# EAGLE design Sequei_board2 (EAGLE 9.1.1)
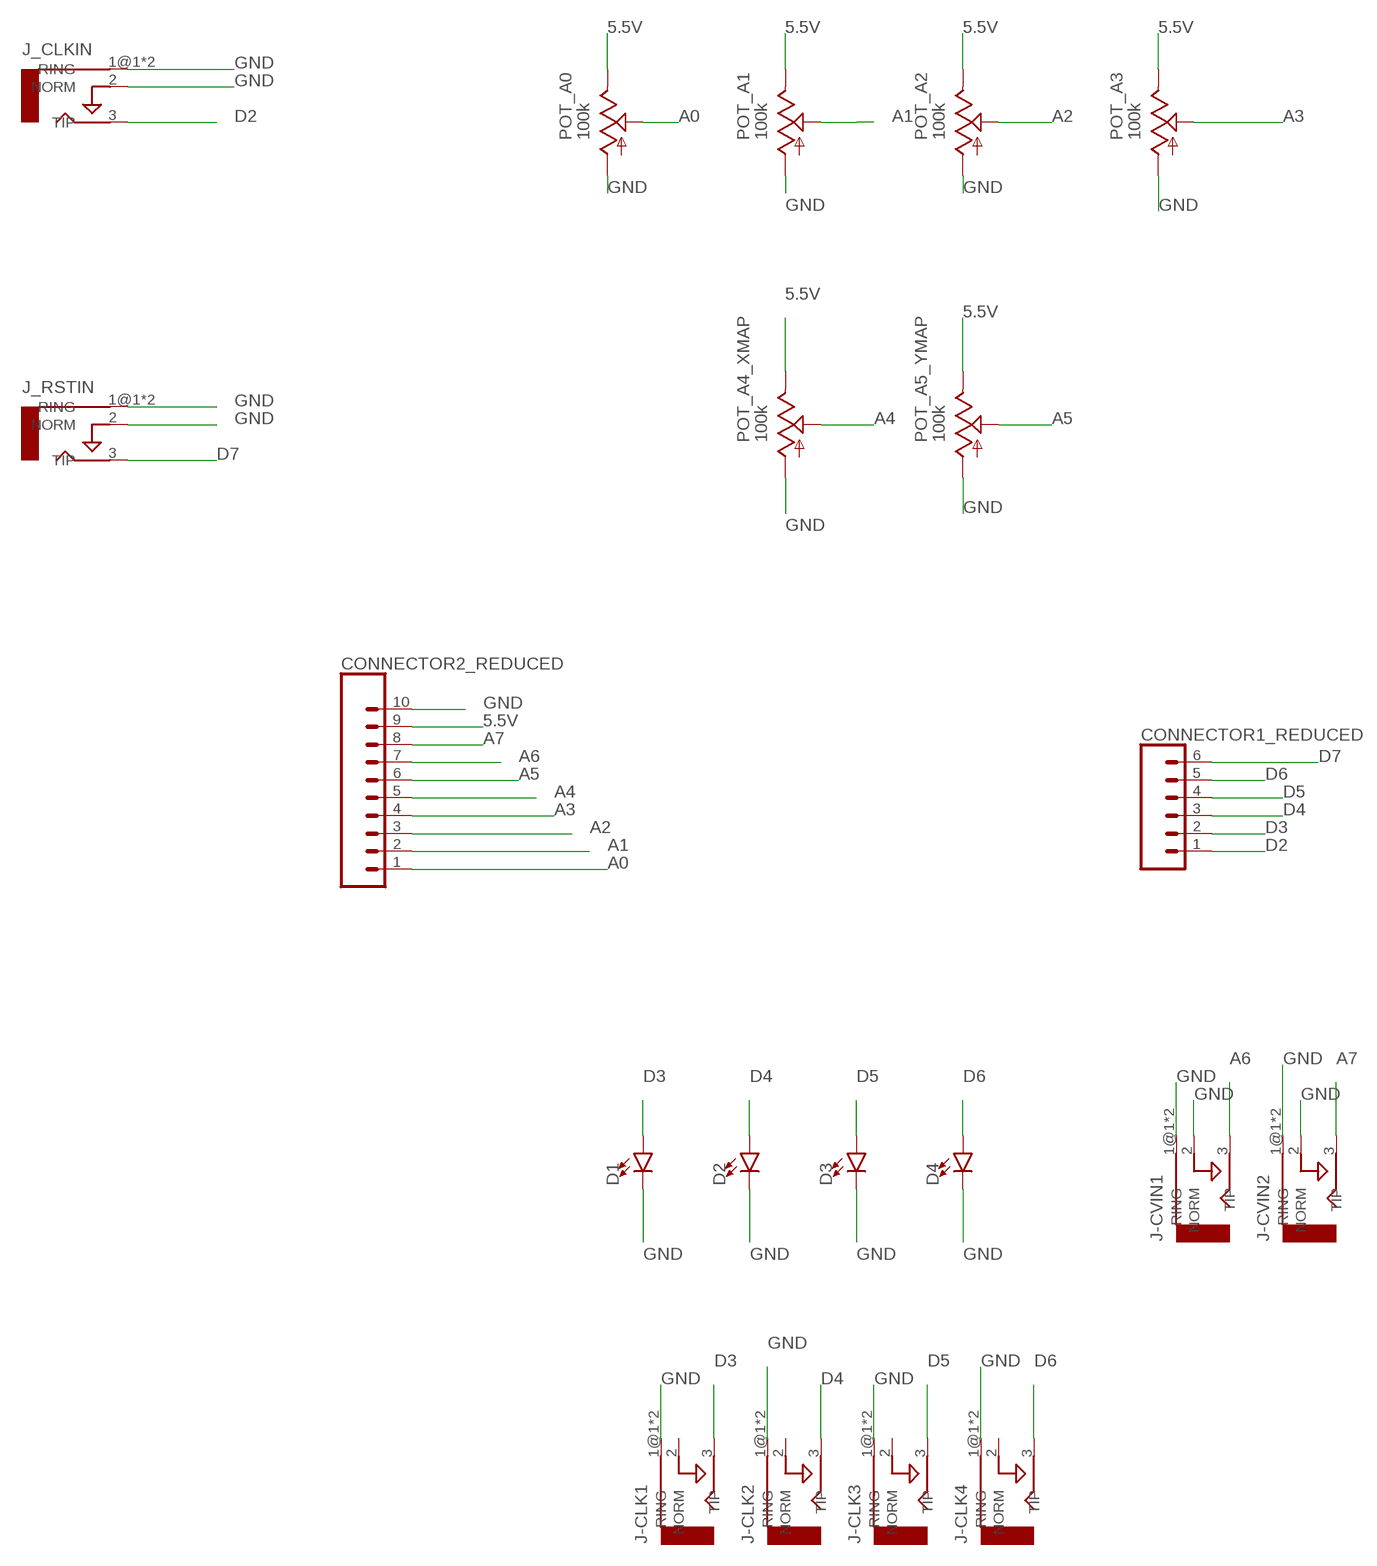
[diagram p0: schematic, sheet 1]

## Parts
CONNECTOR1_REDUCED  CONN_06LONGPADS  [1X06_LONGPADS]
CONNECTOR2_REDUCED  CONN_10_LONGPADS10_LONGPADS  [1X10_LONGPADS]
D1  LED-3MM-NO_SILK  [LED_3MM-NS]
D2  LED-3MM-NO_SILK  [LED_3MM-NS]
D3  LED-3MM-NO_SILK  [LED_3MM-NS]
D4  LED-3MM-NO_SILK  [LED_3MM-NS]
J-CLK1  AUDIO-JACKERTHENVAR  [ERTHENVAR-JACK]
J-CLK2  AUDIO-JACKERTHENVAR  [ERTHENVAR-JACK]
J-CLK3  AUDIO-JACKERTHENVAR  [ERTHENVAR-JACK]
J-CLK4  AUDIO-JACKERTHENVAR  [ERTHENVAR-JACK]
J-CVIN1  AUDIO-JACKERTHENVAR  [ERTHENVAR-JACK]
J-CVIN2  AUDIO-JACKERTHENVAR  [ERTHENVAR-JACK]
J_CLKIN  AUDIO-JACKERTHENVAR  [ERTHENVAR-JACK]
J_RSTIN  AUDIO-JACKERTHENVAR  [ERTHENVAR-JACK]
POT_A0  100k  9MM_SNAP-IN_POT_  [9MM_SNAP-IN_POT]
POT_A1  100k  9MM_SNAP-IN_POT_  [9MM_SNAP-IN_POT]
POT_A2  100k  9MM_SNAP-IN_POT_  [9MM_SNAP-IN_POT]
POT_A3  100k  9MM_SNAP-IN_POT_  [9MM_SNAP-IN_POT]
POT_A4_XMAP  100k  9MM_SNAP-IN_POT_  [9MM_SNAP-IN_POT]
POT_A5_YMAP  100k  9MM_SNAP-IN_POT_  [9MM_SNAP-IN_POT]

## Nets
5.5V: CONNECTOR2_REDUCED.9 POT_A0.3(E) POT_A1.3(E) POT_A2.3(E) POT_A3.3(E) POT_A4_XMAP.3(E) POT_A5_YMAP.3(E)
A0: CONNECTOR2_REDUCED.1 POT_A0.2(S)
A1: CONNECTOR2_REDUCED.2 POT_A1.2(S)
A2: CONNECTOR2_REDUCED.3 POT_A2.2(S)
A3: CONNECTOR2_REDUCED.4 POT_A3.2(S)
A4: CONNECTOR2_REDUCED.5 POT_A4_XMAP.2(S)
A5: CONNECTOR2_REDUCED.6 POT_A5_YMAP.2(S)
A6: CONNECTOR2_REDUCED.7 J-CVIN1.3(TIP)
A7: CONNECTOR2_REDUCED.8 J-CVIN2.3(TIP)
D2: CONNECTOR1_REDUCED.1 J_CLKIN.3(TIP)
D3: CONNECTOR1_REDUCED.2 D1.A J-CLK1.3(TIP)
D4: CONNECTOR1_REDUCED.3 D2.A J-CLK2.3(TIP)
D5: CONNECTOR1_REDUCED.4 D3.A J-CLK3.3(TIP)
D6: CONNECTOR1_REDUCED.5 D4.A J-CLK4.3(TIP)
D7: CONNECTOR1_REDUCED.6 J_RSTIN.3(TIP)
GND: CONNECTOR2_REDUCED.10 D1.K(C) D2.K(C) D3.K(C) D4.K(C) J-CLK1.1@1(RING) J-CLK1.1@2(RING) J-CLK2.1@1(RING) J-CLK2.1@2(RING) J-CLK3.1@1(RING) J-CLK3.1@2(RING) J-CLK4.1@1(RING) J-CLK4.1@2(RING) J-CVIN1.1@1(RING) J-CVIN1.1@2(RING) J-CVIN1.2(NORM) J-CVIN2.1@1(RING) J-CVIN2.1@2(RING) J-CVIN2.2(NORM) J_CLKIN.1@1(RING) J_CLKIN.1@2(RING) J_CLKIN.2(NORM) J_RSTIN.1@1(RING) J_RSTIN.1@2(RING) J_RSTIN.2(NORM) POT_A0.1(A) POT_A1.1(A) POT_A2.1(A) POT_A3.1(A) POT_A4_XMAP.1(A) POT_A5_YMAP.1(A)
Unconnected: J-CLK1.2(NORM) J-CLK2.2(NORM) J-CLK3.2(NORM) J-CLK4.2(NORM)

## Library data of the parts
CONNECTOR1_REDUCED = SparkFun-Connectors:CONN_06: Multi connection point. Often used as Generic Header-pin footprint for 0.1 inch spaced/style header connections On any of the 0.1 inch spaced packages, you can populate with these: Break Away Headers - Straight <https://www.sparkfun.com/products/116> (PRT-00116) Break Away Male Headers - Right Angle <https://www.sparkfun.com/products/553> (PRT-00553) Female Headers <https://www.sparkfun.com/products/115> (PRT-00115) Break Away Headers - Machine Pin <https://www.sparkfun.com/products/117> (PRT-00117) Break Away Female Headers - Swiss Machine Pin <https://www.sparkfun.com/products/743> (PRT-00743) Arduino Stackable Header - 6 Pin <https://www.sparkfun.com/products/9280> (PRT-09280) For SCREWTERMINALS and SPRING TERMINALS visit here: Screw Terimnals on SparkFun.com <https://www.sparkfun.com/search/results?term=Screw+Terminals> (5mm/3.5mm/2.54mm spacing) This device is also useful as a general connection point to wire up your design to another part of your project. Our various solder wires solder well into these plated through hole pads. Hook-Up Wire - Assortment (Stranded, 22 AWG) <https://www.sparkfun.com/products/11375> (PRT-11375) Hook-Up Wire - Assortment (Solid Core, 22 AWG) <https://www.sparkfun.com/products/11367> (PRT-11367) View the entire wire category on our website here <https://www.sparkfun.com/categories/141>
CONNECTOR2_REDUCED = 10_Long_Pads:CONN_10_LONGPADS: Multi connection point. Often used as Generic Header-pin footprint for 0.1 inch spaced/style header connections On any of the 0.1 inch spaced packages, you can populate with these: Break Away Headers - Straight <https://www.sparkfun.com/products/116> (PRT-00116) Break Away Male Headers - Right Angle <https://www.sparkfun.com/products/553> (PRT-00553) Female Headers <https://www.sparkfun.com/products/115> (PRT-00115) Break Away Headers - Machine Pin <https://www.sparkfun.com/products/117> (PRT-00117) Break Away Female Headers - Swiss Machine Pin <https://www.sparkfun.com/products/743> (PRT-00743) For SCREWTERMINALS and SPRING TERMINALS visit here: Screw Terimnals on SparkFun.com <https://www.sparkfun.com/search/results?term=Screw+Terminals> (5mm/3.5mm/2.54mm spacing) This device is also useful as a general connection point to wire up your design to another part of your project. Our various solder wires solder well into these plated through hole pads. Hook-Up Wire - Assortment (Stranded, 22 AWG) <https://www.sparkfun.com/products/11375> (PRT-11375) Hook-Up Wire - Assortment (Solid Core, 22 AWG) <https://www.sparkfun.com/products/11367> (PRT-11367) View the entire wire category on our website here <https://www.sparkfun.com/categories/141>
D1-D4 = SparkFun-LED:LED: LED (Generic) Standard schematic elements and footprints for 5mm, 3mm, 1206, and 0603 sized LEDs. Generic LEDs with no color specified.
J-CLK1-J-CLK4 J-CVIN1 J-CVIN2 J_CLKIN J_RSTIN = erthenvar:AUDIO-JACK: Switching Mono 3.5mm Audio Jack from Erthenvar.
POT_A0 POT_A1-POT_A3 POT_A4_XMAP POT_A5_YMAP = MusicThingModular:9MM_SNAP-IN_POT: 9mm vertical snap-in pot, Alpha / Panasonic style

## Board
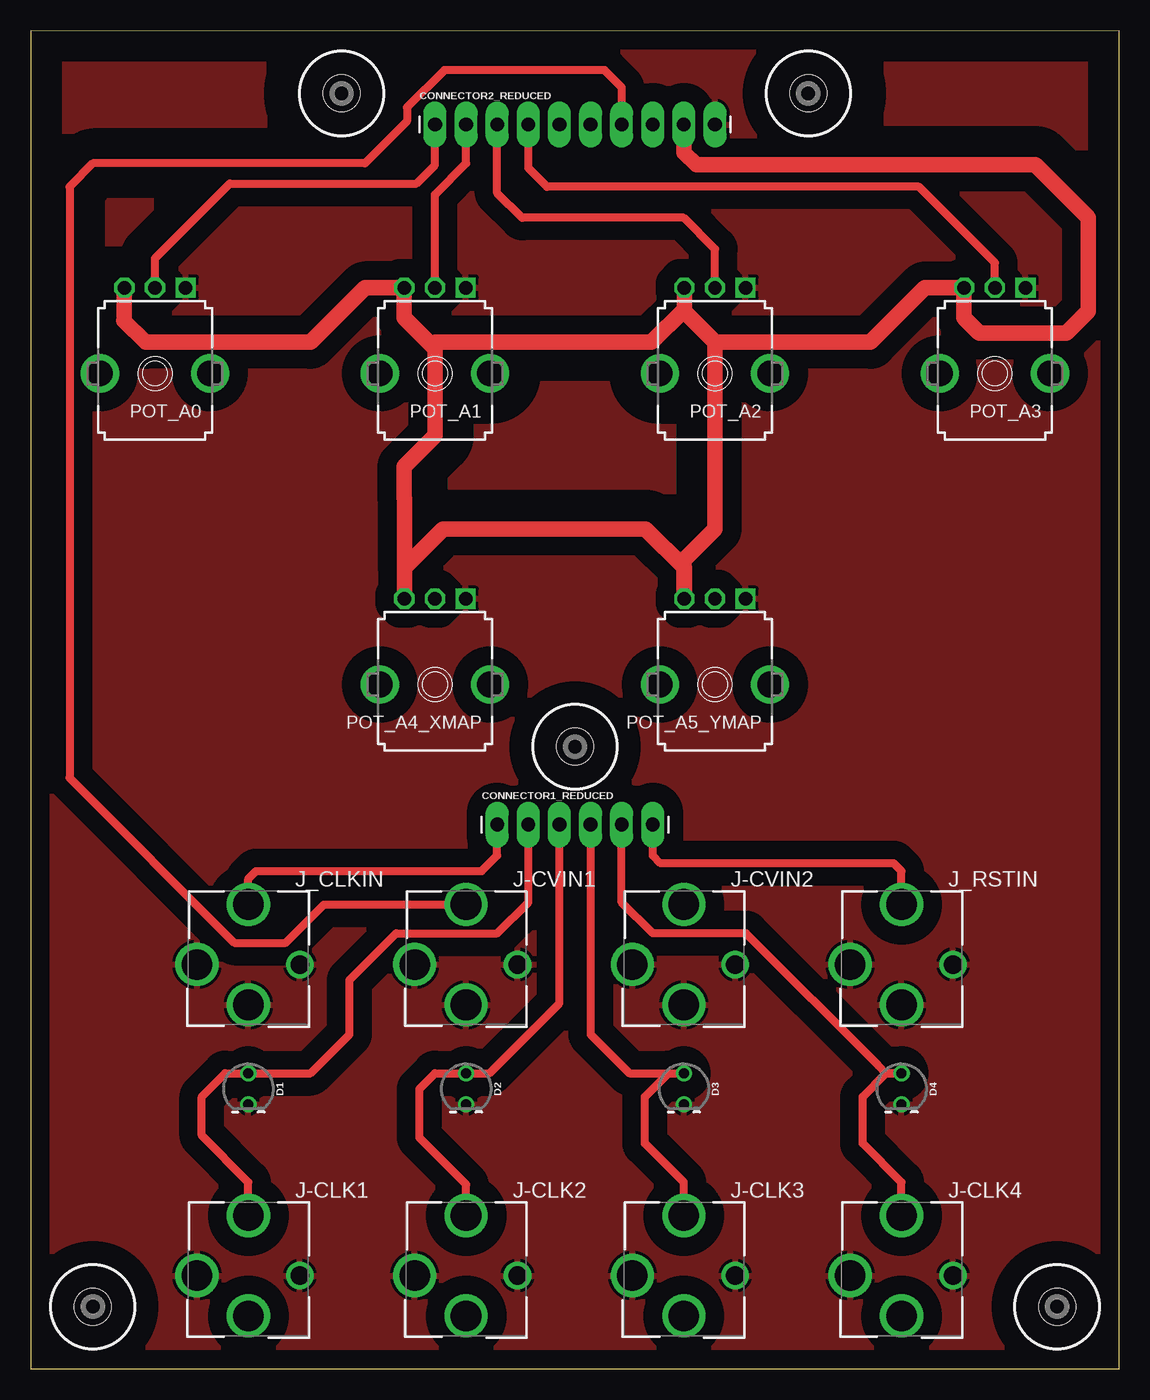
[diagram p1: board, top side]
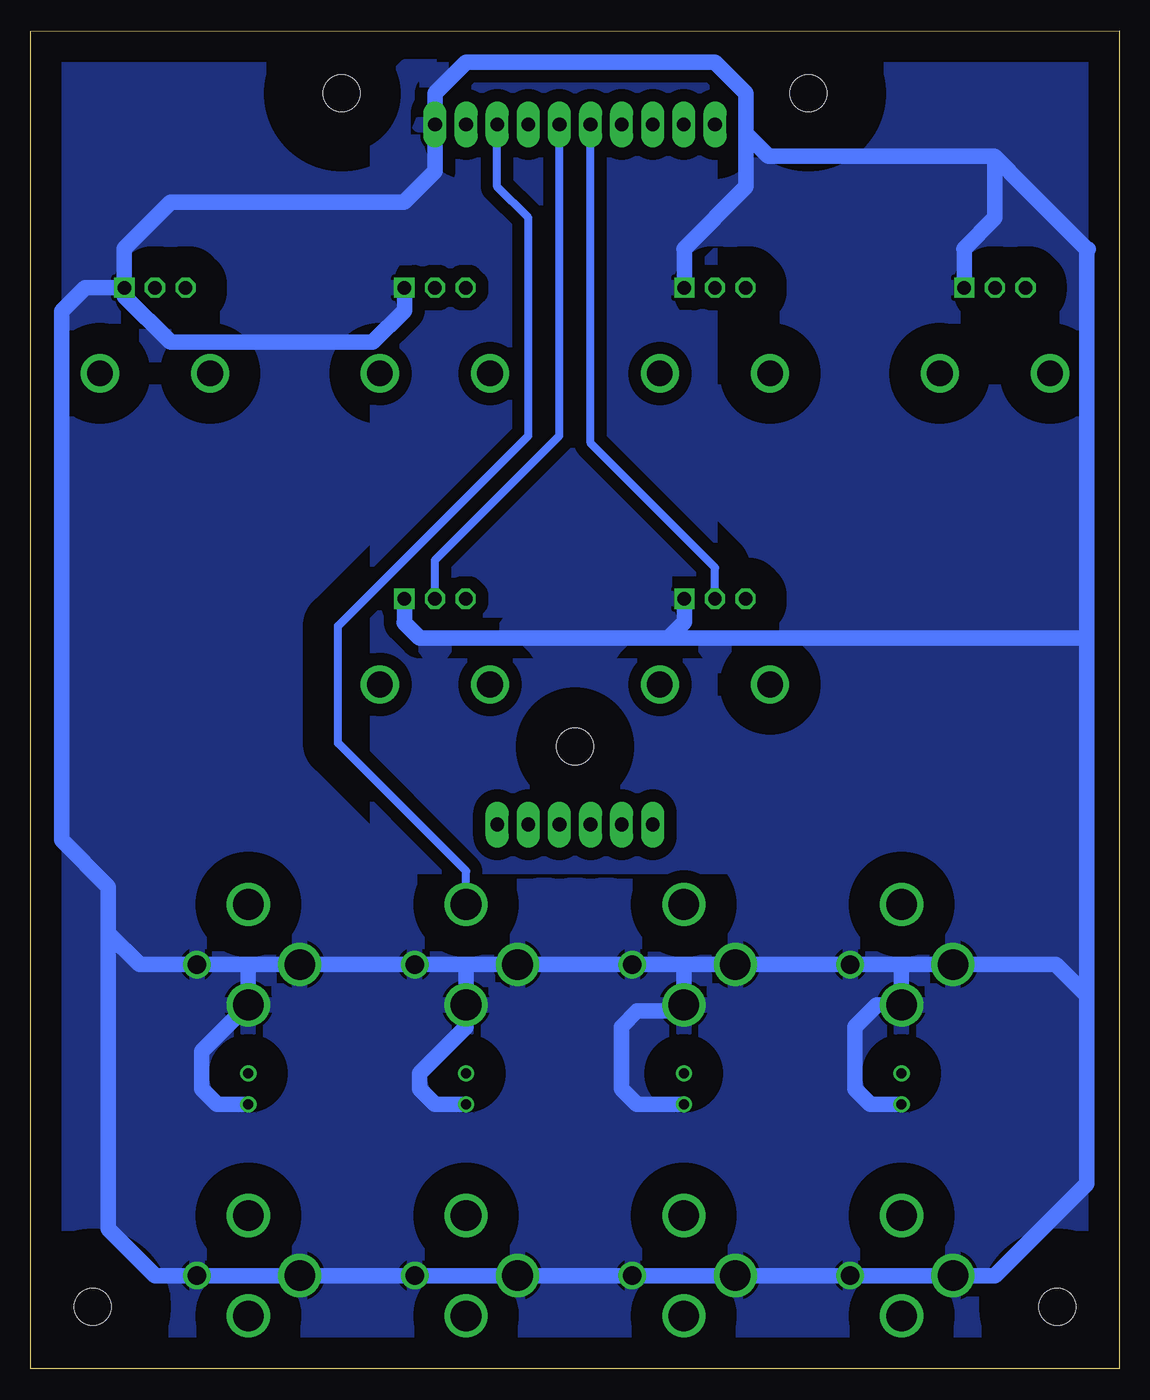
[diagram p2: board, bottom side, seen from below]

Size 88.9 x 109.27 mm. Coordinates in mm from the lower left corner, seen from the top.
Outline: 0,0 88.9,0 88.9,109.22 0,109.27 0,0
Copper layers (1*16): Top 0.035mm / dielectric 1.5mm / Bottom 0.035mm
Design rules "default *": minimum track width 24mil, minimum drill 0.35mm, track to track 6mil, track to pad 6mil, pad to pad 6mil, via to via 6mil, smd to smd 6mil, copper to edge 40mil, drill to drill 12mil, minimum pad ring 10mil, minimum via ring 8mil, stop-mask expansion 4mil, vias tented up to drill 0mil, thermal gap 10mil

### Footprints (pad centres in the part's own frame; a part is rotated, then mirrored left to right if it is on the bottom)
1X06_LONGPADS = drill 1.118 pad 1.88 long: 1 0,0; 2 2.54,0; 3 5.08,0; 4 7.62,0; 5 10.16,0; 6 12.7,0
1X10_LONGPADS = drill 1.118 pad 1.88 long: 1 0,0; 2 2.54,0; 3 5.08,0; 4 7.62,0; 5 10.16,0; 6 12.7,0; 7 15.24,0; 8 17.78,0; 9 20.32,0; 10 22.86,0
LED_3MM-NS = drill 0.813: A -1.27,0; K 1.27,0
DRIL-3 = hole 3: 0,0
ERTHENVAR-JACK = drill 2.5: 1@1 -4.2,0; 2 0,-3.3; 3 0,4.9 | drill 1.5: 1@2 4.2,0
9MM_SNAP-IN_POT = drill 1.1 square: 1 -2.5,-7 | drill 1.1 octagon: 2 0,-7; 3 2.5,-7 | drill 2.1 pad 2.794: CHASSIS1 -4.5,0; CHASSIS2 4.5,0

### Placement (x,y rotation side)
CONNECTOR1_REDUCED  38.1,44.45 0 top
CONNECTOR2_REDUCED  33.02,101.6 0 top
D1  17.78,22.86 270 top
D2  35.56,22.86 270 top
D3  53.34,22.86 270 top
D4  71.12,22.86 270 top
H1  [DRIL-3]  25.4,104.14 0 top
H2  [DRIL-3]  63.5,104.14 0 top
H3  [DRIL-3]  83.82,5.08 0 top
H4  [DRIL-3]  5.08,5.08 0 top
H5  [DRIL-3]  44.45,50.8 0 top
J-CLK1  17.78,7.62 0 top
J-CLK2  35.56,7.62 0 top
J-CLK3  53.34,7.62 0 top
J-CLK4  71.12,7.62 0 top
J-CVIN1  35.56,33.02 0 top
J-CVIN2  53.34,33.02 0 top
J_CLKIN  17.78,33.02 0 top
J_RSTIN  71.12,33.02 0 top
POT_A0  10.16,81.28 180 top
POT_A1  33.02,81.28 180 top
POT_A2  55.88,81.28 180 top
POT_A3  78.74,81.28 180 top
POT_A4_XMAP  33.02,55.88 180 top
POT_A5_YMAP  55.88,55.88 180 top

### Tracks (layer width: path | path; a pad name or v marks a point on that pad's centre or on a via)
5.5V
  Top 1.27: 55.88,83.82 53.38,86.32 POT_A2.3 53.38,86.5 50.7,83.82 33.02,83.82 33.02,83.31 | 55.88,83.82 55.88,81.28 55.88,78.74 55.88,68.58 53.34,66.04 53.34,62.92 POT_A5_YMAP.3 53.38,65.42 50.22,68.58 33.68,68.58 30.52,65.42 | 30.52,65.42 POT_A4_XMAP.3 | 33.02,83.31 30.48,85.85 30.48,88.24 POT_A1.3 27.32,88.28 22.86,83.82 9.4,83.82 7.62,85.6 7.66,85.64 POT_A0.3 | 30.52,65.42 30.52,71.08 30.48,71.12 30.48,73.66 33.02,76.2 33.02,83.31 | 55.88,83.82 | 55.88,83.82 68.58,83.82 73.04,88.28 POT_A3.3 76.2,88.24 76.2,85.85 77.47,84.58 84.58,84.58 86.36,86.36 86.36,93.98 82.04,98.3 54.35,98.3 53.34,99.31 CONNECTOR2_REDUCED.9
A0
  Top 0.635: POT_A0.2 10.16,90.68 10.41,90.93 16.26,96.77 31.5,96.77 33.02,98.3 CONNECTOR2_REDUCED.1
A1
  Top 0.635: CONNECTOR2_REDUCED.2 35.56,98.42 33.02,95.89 POT_A1.2
A2
  Top 0.635: POT_A2.2 55.88,91.44 53.34,93.98 40.13,93.98 38.1,96.01 CONNECTOR2_REDUCED.3
A3
  Top 0.635: CONNECTOR2_REDUCED.4 40.64,98.04 42.16,96.52 72.53,96.52 78.74,90.31 POT_A3.2
A4
  Bottom 0.635: CONNECTOR2_REDUCED.5 43.18,75.58 33.02,65.42 POT_A4_XMAP.2
A5
  Bottom 0.635: POT_A5_YMAP.2 55.88,66.04 45.72,76.2 CONNECTOR2_REDUCED.6
A6
  Top 0.635: 33.78,106.05 46.86,106.05 48.26,104.65 CONNECTOR2_REDUCED.7 | J-CVIN1.3 23.95,37.92 20.83,34.8 16.64,34.8 3.17,48.26 3.17,96.52 5.08,98.42 27.3,98.42 30.73,101.85 30.73,103 33.78,106.05 | 33.78,106.05
A7
  Bottom 0.635: CONNECTOR2_REDUCED.8 50.8,96.52 48.26,93.98 48.26,76.2 58.42,66.04 63.8,60.66 63.8,51.1 53.34,40.64 J-CVIN2.3
D2
  Top 0.635: J_CLKIN.3 17.78,40.01 18.41,40.64 36.83,40.64 38.1,41.91 CONNECTOR1_REDUCED.1
D3
  Top 0.635: J-CLK1.3 17.78,15.24 13.97,19.05 13.97,22.23 15.88,24.13 D1.A 22.86,24.13 26.04,27.3 26.04,31.75 29.84,35.56 38.1,35.56 40.64,38.1 CONNECTOR1_REDUCED.2
D4
  Top 0.635: CONNECTOR1_REDUCED.3 43.18,29.84 37.47,24.13 D2.A 33.02,24.13 31.75,22.86 31.75,18.87 35.56,15.06 J-CLK2.3
D5
  Top 0.635: J-CLK3.3 53.34,15.24 50.16,18.41 50.16,22.23 52.07,24.13 D3.A 48.9,24.13 45.72,27.3 CONNECTOR1_REDUCED.4
D6
  Top 0.635: J-CLK4.3 71.12,15.24 67.94,18.41 67.94,22.23 69.85,24.13 | 69.85,24.13 D4.A 69.85,24.13 | 69.85,24.13 69.22,24.77 | 69.22,24.77 | 69.22,24.77 58.42,35.56 56.52,35.56 50.8,35.56 48.26,38.1 CONNECTOR1_REDUCED.5
D7
  Top 0.635: J_RSTIN.3 71.12,40.64 70.48,41.27 51.44,41.27 50.8,41.91 CONNECTOR1_REDUCED.6
GND
  Bottom 1.27: 17.78,33.02 15.24,33.02 J_CLKIN.1@1 5.21,33.02 2.67,30.48 | 17.78,33.02 J_CLKIN.1@2 J-CVIN1.1@1 35.56,33.02 | 17.78,33.02 J_CLKIN.2 19.81,29.72 21.59,27.94 21.59,22.86 20.32,21.59 D1.K | 35.56,33.02 J-CVIN1.1@2 J-CVIN2.1@1 53.34,33.02 | 35.56,33.02 J-CVIN1.2 35.56,29.21 39.37,29.21 40.64,27.94 40.64,22.86 39.37,21.59 38.1,21.59 D2.K | 53.34,33.02 J-CVIN2.1@2 J_RSTIN.1@1 71.12,33.02 | 53.34,33.02 J-CVIN2.2 53.34,27.94 57.15,24.13 57.15,22.86 55.88,21.59 D3.K | 71.12,33.02 74.93,33.02 | 74.93,33.02 J_RSTIN.1@2 | 71.12,33.02 J_RSTIN.2 74.93,25.91 74.93,22.86 73.66,21.59 D4.K | POT_A3.1 81.24,87.59 77.47,83.82 60.96,83.82 58.38,86.4 POT_A2.1 | POT_A5_YMAP.1 58.38,61 58.42,60.96 57.15,59.69 36.83,59.69 | POT_A4_XMAP.1 35.52,61 36.83,59.69 | 2.67,91.44 2.67,84.45 2.67,59.69 | 2.67,30.48 2.67,15.11 10.16,7.62 J-CLK1.1@1 J-CLK1.1@2 J-CLK2.1@1 J-CLK2.1@2 J-CLK3.1@1 J-CLK3.1@2 J-CLK4.1@1 J-CLK4.1@2 78.74,7.62 82.55,11.43 82.55,33.02 82.55,35.56 | 2.67,30.48 2.67,33.02 2.67,59.69 | 2.67,59.69 36.83,59.69 | POT_A3.1 84.44,88.28 86.36,86.36 86.36,43.18 82.55,39.37 82.55,35.56 | POT_A3.1 81.24,91.48 77.47,95.25 58.42,95.25 55.88,97.79 CONNECTOR2_REDUCED.10 55.88,104.14 53.34,106.68 33.02,106.68 30.48,104.14 30.48,100.84 | POT_A1.1 35.52,91.4 35.56,91.44 30.48,96.52 30.48,99.44 30.48,99.69 30.48,100.84 | 82.55,35.56 80.01,33.02 74.93,33.02 | 10.22,99 7.68,96.46 2.67,91.44 | 2.67,91.44 2.54,91.44 2.67,91.44 | POT_A0.1 12.66,91.4 12.7,91.44 10.16,93.98 10.16,98.93 10.22,99 | 30.48,100.84 28.64,99 10.22,99
  pour Top (isolate 1.524): 0,0 0,109.22 88.9,109.22 88.9,0
  pour Bottom (isolate 2.54): 0,0 0,109.22 88.9,109.22 88.9,0
N$1
  pour Top (isolate 2.54): 0,48.26 88.9,48.26 88.9,109.22 0,109.22
N$2
  pour Bottom (isolate 5.08): 0,38.1 0,109.22 88.9,109.22 88.9,38.1
N$3
  pour Bottom (isolate 1.016): 60.96,40.64 27.94,40.64 33.02,45.72 33.02,106.68 58.42,106.68 60.96,104.14

### Text on the board
tDocu: A0 | A7 | 5.5V | GND | D2 | D7